# Altium schematic sheet Applicaties.SchDoc
size A4; SheetNumber: 3; SheetTotal: 5
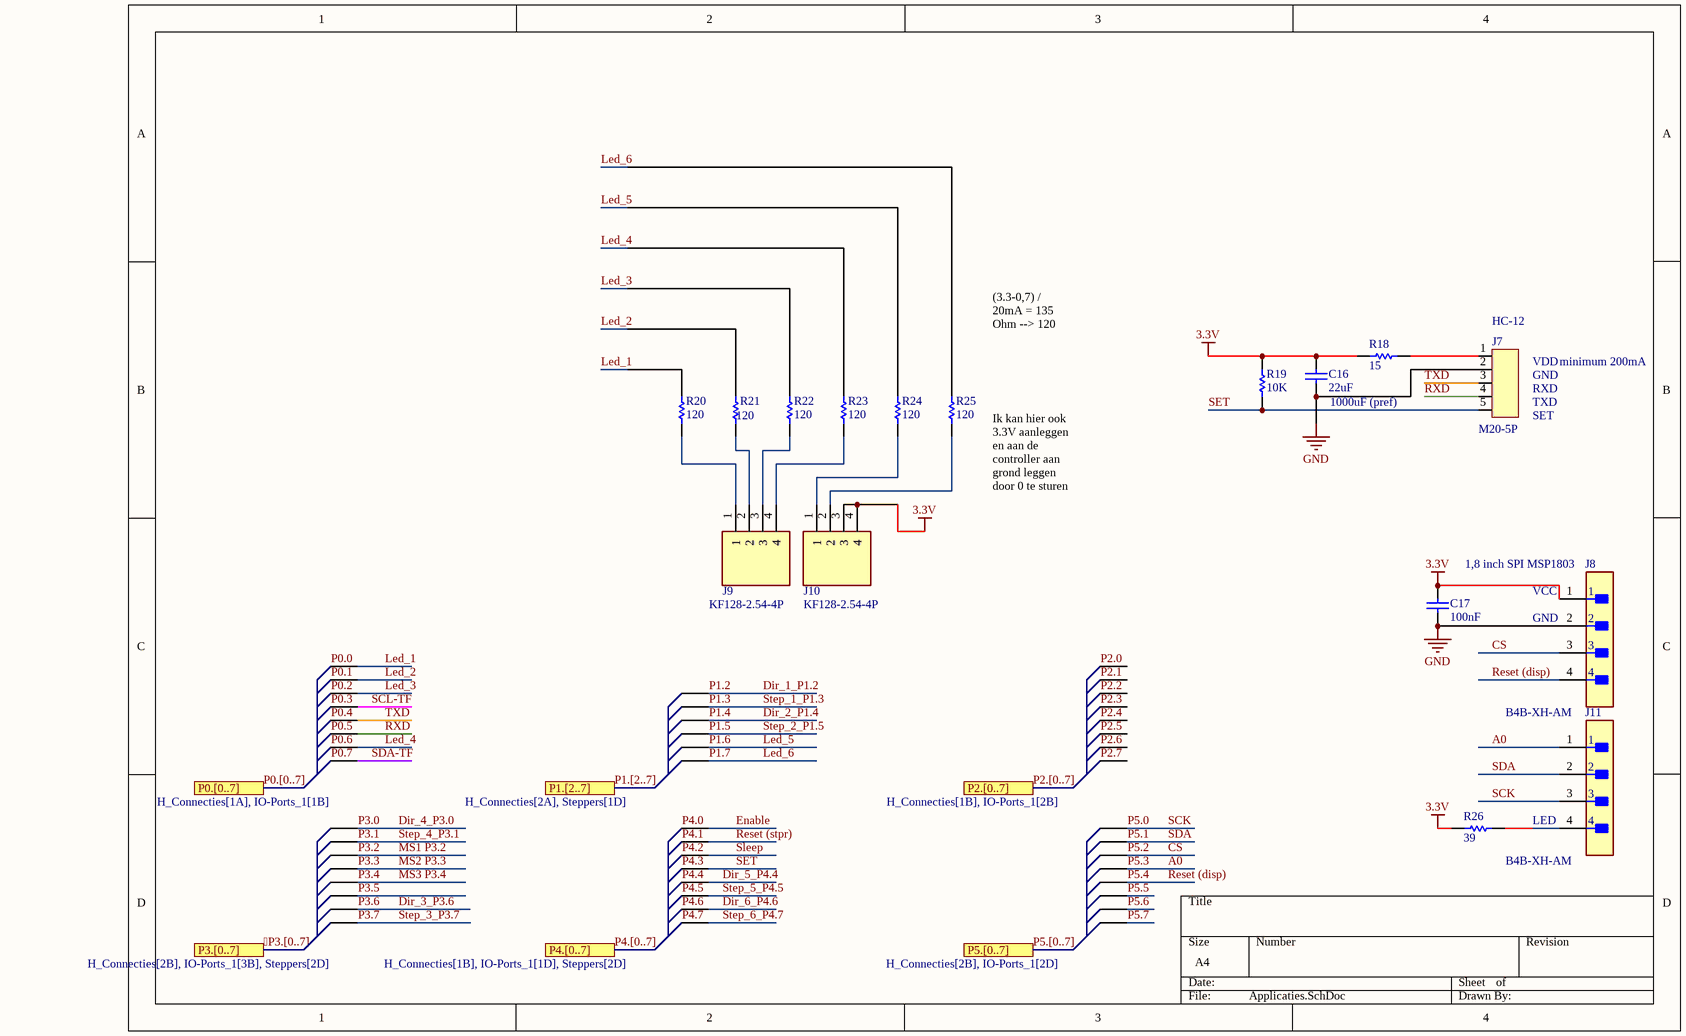
[diagram p0: Applicaties.SchDoc]

## Parts
C16  22uF  [CAPC1608X90X35LL15T15]
C17  100nF  [CAPC1608X90X35LL15T15]
J7  M20-5P  [M20-5PIN]
J8  B4B-XH-AM  [FP-B4B-XH-A_LF_SN-MFG]
J9  KF128-2.54-4P  [KF128-2.54-4P]
J10  KF128-2.54-4P  [KF128-2.54-4P]
J11  B4B-XH-AM  [FP-B4B-XH-A_LF_SN-MFG]
R18  15  [RESC1608X55X25LL10T15]
R19  10K  [RESC1608X55X25LL10T15]
R20  120  [RESC1608X55X25LL10T15]
R21  120  [RESC1608X55X25LL10T15]
R22  120  [RESC1608X55X25LL10T15]
R23  120  [RESC1608X55X25LL10T15]
R24  120  [RESC1608X55X25LL10T15]
R25  120  [RESC1608X55X25LL10T15]
R26  39  [RESC1608X55X25LL10T15]

## Ports
P0.[0..7] (see H_Connecties[1A], IO-Ports_1[1B]), P1.[2..7] (see H_Connecties[2A], Steppers[1D]), P2.[0..7] (see H_Connecties[1B], IO-Ports_1[2B]), P3.[0..7] (see H_Connecties[2B], IO-Ports_1[3B], Steppers[2D]), P4.[0..7] (see H_Connecties[1B], IO-Ports_1[1D], Steppers[2D]), P5.[0..7] (see H_Connecties[2B], IO-Ports_1[2D])

## Nets
3.3V: C16.2 C17.2 J8.1 J10.3 J10.4 R18.2 R19.1 R26.1
GND: C16.1 C17.1 J7.2 J8.2
A0: J11.1  [also labelled P5.3]
CS: J8.3  [also labelled P5.2]
Led_1: R20.1  [also labelled P0.0]
Led_2: R21.1  [also labelled P0.1]
Led_3: R22.1  [also labelled P0.2]
Led_4: R23.1  [also labelled P0.6]
Led_5: R24.1  [also labelled P1.6]
Led_6: R25.1  [also labelled P1.7]
P0.4: J7.3  [also labelled TXD]
P0.5: J7.4  [also labelled RXD]
P4.3: J7.5 R19.2  [also labelled SET]
P5.0: J11.3  [also labelled SCK]
P5.1: J11.2  [also labelled SDA]
P5.4: J8.4  [also labelled Reset (disp)]
NetJ7_1: J7.1 R18.1
NetJ9_1: J9.1 R20.2
NetJ9_2: J9.2 R21.2
NetJ9_3: J9.3 R22.2
NetJ9_4: J9.4 R23.2
NetJ10_1: J10.1 R24.2
NetJ10_2: J10.2 R25.2
NetJ11_4: J11.4 R26.2

## Buses and harness runs
bus P3.[0..7] =  = port P3.[0..7]
bus P0.[0..7] = port P0.[0..7]
bus P1.[2..7] =  = port P1.[2..7]
bus P2.[0..7] = port P2.[0..7]
bus P4.[0..7] = port P4.[0..7]
bus P5.[0..7] =  = port P5.[0..7]

## Notes on the sheet
- (near R25) (3.3-0,7) / 20mA = 135 Ohm --> 120
- (near J7) HC-12
- (near J7) VDD
- (near J7) GND
- minimum 200mA
- (near C16) 1000uF (pref)
- (near J7) RXD
- (near J7) TXD
- (near J7) SET
- (near R25) Ik kan hier ook 3.3V aanleggen en aan de controller aan grond leggen door 0 te sturen (naar grond trekken)
  dan moet de controller geen stroom leveren
- 1,8 inch SPI MSP1803
- (near J8) VCC
- (near J8) GND
- LED

## Library data of the parts
C16 C17 = CMP-2006-02133-1: Manufacturer: AVX Interconnect / Elco; Part Number: 0603ZC101KAT2A
J8 J11 = CMP-17439-000250-1: CONN HEADER VERT 4POS 2.5MM; Number of Contacts: 4; Contact Resistance: 20mR; Voltage Rating: 250V; Max Current Rating: 3A; Gender: Male; Wire/Cable Gauge: 22AWG; Mated Stacking Heights: 9.8mm; Insulation Resistance: 1GR; Orientation: Straight; Contact Type: Male Pin; Contact Finish - Mating: TIN; Series: XH; Max Voltage Rating (AC): 250V; Lead Pitch: 2.5mm; Contact Shape: Square; Insulation Color: Natural; Termination: Solder; Lead Free: Lead Free; Voltage Rating (AC): 250V; Number of Rows: 1; Flammability Rating: UL94 V-0; Number of Positions: 4; Max Operating Temperature: 85°C; Package Quantity: 500; Mount: Through Hole; REACH SVHC: No SVHC; Connector Type: Header; Insulation Material: Nylon; Fastening Type: Detent; Min Operating Temperature: -25°C; Housing Color: White; Packaging: Bulk; Contact Plating: Tin; Contact Material: Brass; Max Voltage Rating (DC): 250V; Housing Material: Polyamide; Color: Natural; Material: Polyamide; Pitch: 2.5mm; Depth: 5.75mm; Current Rating: 3A; Length: 12.4mm
J9 J10 = KF128-2.54-4P: Connector; Manufacturer_Name: CIXI KEFA ELECTRONICS; Datasheet Link: https://jirorwxhqiillo5p.ldycdn.com/KF128-2.54-aidqpBpqKirRliSqmrqirlki.pdf; Height: 9.1mm; Manufacturer_Part_Number: KF128-2.54-4P
R18-R26 = CMP-2000-04183-1: Part Number: RC0603FR-102KL; Manufacturer: Yageo